# Altium schematic sheet V1.1.SchDoc
size 198 x 83 mm
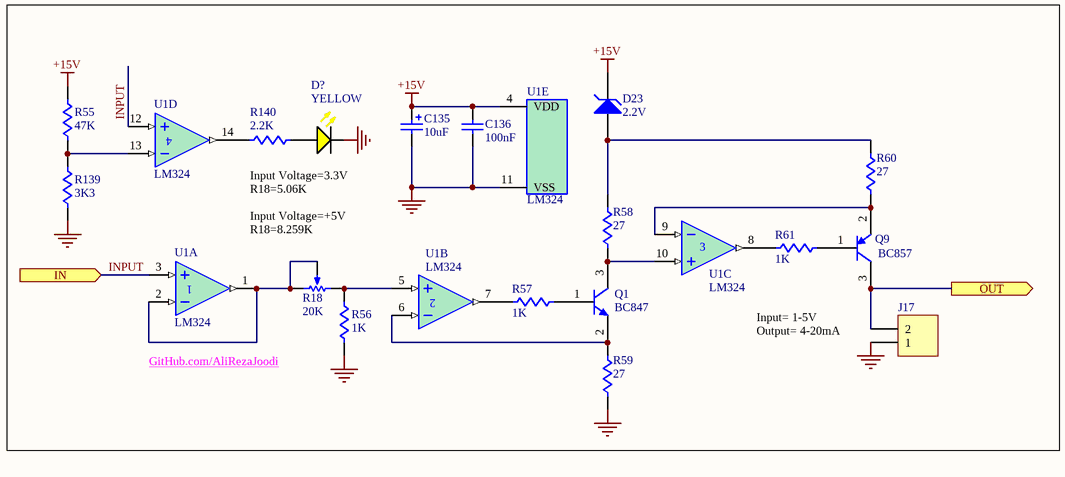
[diagram p0: V1.1.SchDoc]

## Parts
C135  value 10uF  [Cap_B]  (hidden comment: Capacitor)
C136  value 100nF  [0805]  (hidden comment: Cap)
D23  value 2.2V  [MELF-D3516-1406]  (hidden comment: LED)
D?  YELLOW  [LED_THD_3MM_YELLOW_R]
J17  J17  [Fonics_2PIN_1]  (value not drawn)
Q1  value BC847  [SOT23-3N]  (hidden comment: NPN)
Q9  value BC857  [SOT23-3N]  (hidden comment: Q)
R18  value 20K  [VR4_]  (hidden comment: RES)
R55  value 47K  [0805]  (hidden comment: Res)
R56  value 1K  [0805]  (hidden comment: RES)
R57  value 1K  [0805]  (hidden comment: RES)
R58  value 27  [0805]  (hidden comment: R58)
R59  value 27  [0805]  (hidden comment: R59)
R60  value 27  [0805]  (hidden comment: R60)
R61  value 1K  [0805]  (hidden comment: R61)
R139  3K3  [0805]
R140  value 2.2K  [0805]  (hidden comment: Res)
U1  LM324  [DIP_14]  (parts A,B,C,D,E of 5)

## Ports
IN (in), OUT (out)

## Nets
+15V: C135.1 C136.2 D23.2(K) R55.1 U1.4(VDD)
GND: C135.2 C136.1 D?.2(K) J17.1 R56.2 R59.1 R139.2 U1.11(VSS)
INPUT: U1.3(IN+) U1.12(IN+) ; port IN
OUT: J17.2 Q9.3(C) ; port OUT
NetD23_1: D23.1(A) R58.2 R60.2
NetD?_1: D?.1(A) R140.1
NetQ1_1: Q1.1(B) R57.2
NetQ1_2: Q1.2(E) R59.2 U1.6(IN-)
NetQ1_3: Q1.3(C) R58.1 U1.10(IN+)
NetQ9_1: Q9.1(B) R61.2
NetQ9_2: Q9.2(E) R60.1 U1.9(IN-)
NetR18_1: R18.1(TOP) R56.1 U1.5(IN+)
NetR18_2: R18.2(BOT) R18.3(TAP) U1.1(OUT) U1.2(IN-)
NetR55_2: R55.2 R139.1 U1.13(IN-)
NetR57_1: R57.1 U1.7(OUT)
NetR61_1: R61.1 U1.8(OUT)
NetR140_2: R140.2 U1.14(OUT)

## Notes on the sheet
- Input Voltage=3.3V
  R18=5.06K
  Input Voltage=+5V
  R18=8.259K
- GitHub.com/AliRezaJoodi
- Input= 1-5V
  Output= 4-20mA

## Library data of the parts
C135 = Cap Pol1: Polarized Capacitor (Radial); Manufacturer: Generic Components; Class I: Passive; Published: 8-Jun-2000; Revision: July-2002: Re-released for DXP Platform.; Publisher: Altium Limited; Class II: Capacitor
C136 = Cap: Capacitor; Manufacturer: Generic Components; Class I: Passive; Published: 8-Jun-2000; Revision: July-2002: Re-released for DXP Platform.; Publisher: Altium Limited; Class II: Capacitor
D23 = D Zener: Zener Diode; Manufacturer: Generic Components; Class I: Discrete; Class II: Diode - Zener; Published: 8-Jun-2000; Revision: July-2002: Re-released for DXP Platform.; Publisher: Altium Limited
D? = LED_YELLOW: LED, Yellow; Manufacturer: Generic Components; Class I: Optoelectronic; Published: 8-Jun-2000; Revision: July-2002: Re-released for DXP Platform.; Publisher: Altium Limited; Class II: LED
J17 = Header 2: Header, 2-Pin; LatestRevisionDate: 17-Jul-2002; LatestRevisionNote: Re-released for DXP Platform.; Publisher: Altium Limited
Q1 = BC847: Silicon Bipolar Transistor
Q9 = BC857: Silicon Bipolar Transistor
R18 = RPot1: Potentiometer; Manufacturer: Generic Components; Class I: Passive; Set Position: 0.5; Published: 8-Jun-2000; Revision: July-2002: Re-released for DXP Platform.; Publisher: Altium Limited; Class II: Potentiometer
R55-R61 R139 R140 = Res1: Resistor; Manufacturer: Generic Components; Class I: Passive; Published: 8-Jun-2000; Revision: July-2002: Re-released for DXP Platform.; Publisher: Altium Limited; Class II: Resistor
U1 = LM324: Quad Low-Power Operational Amplifier; Published: 17-Jul-2002; LatestRevisionDate: 06-Jun-2005; LatestRevisionNote: Stylized 3D Model Added.; DatasheetVersion: 1988; PackageVersion: 1997; PackageReference: 646-06; Publisher: Altium Limited; PackageDescription: DIP; 14 Leads; Row Spacing 7.62 mm; Pitch 2.54 mm; ComponentLink1Description: Manufacturer Link; ComponentLink1URL: http://www.onsemi.com/site/products/parametrics/0,4446,251,00.html; ComponentLink2Description: Datasheet; ComponentLink2URL: http://www.onsemi.com/pub/Collateral/LM324-D.PDF